# Altium project G431_MCU_Board.PrjPcb
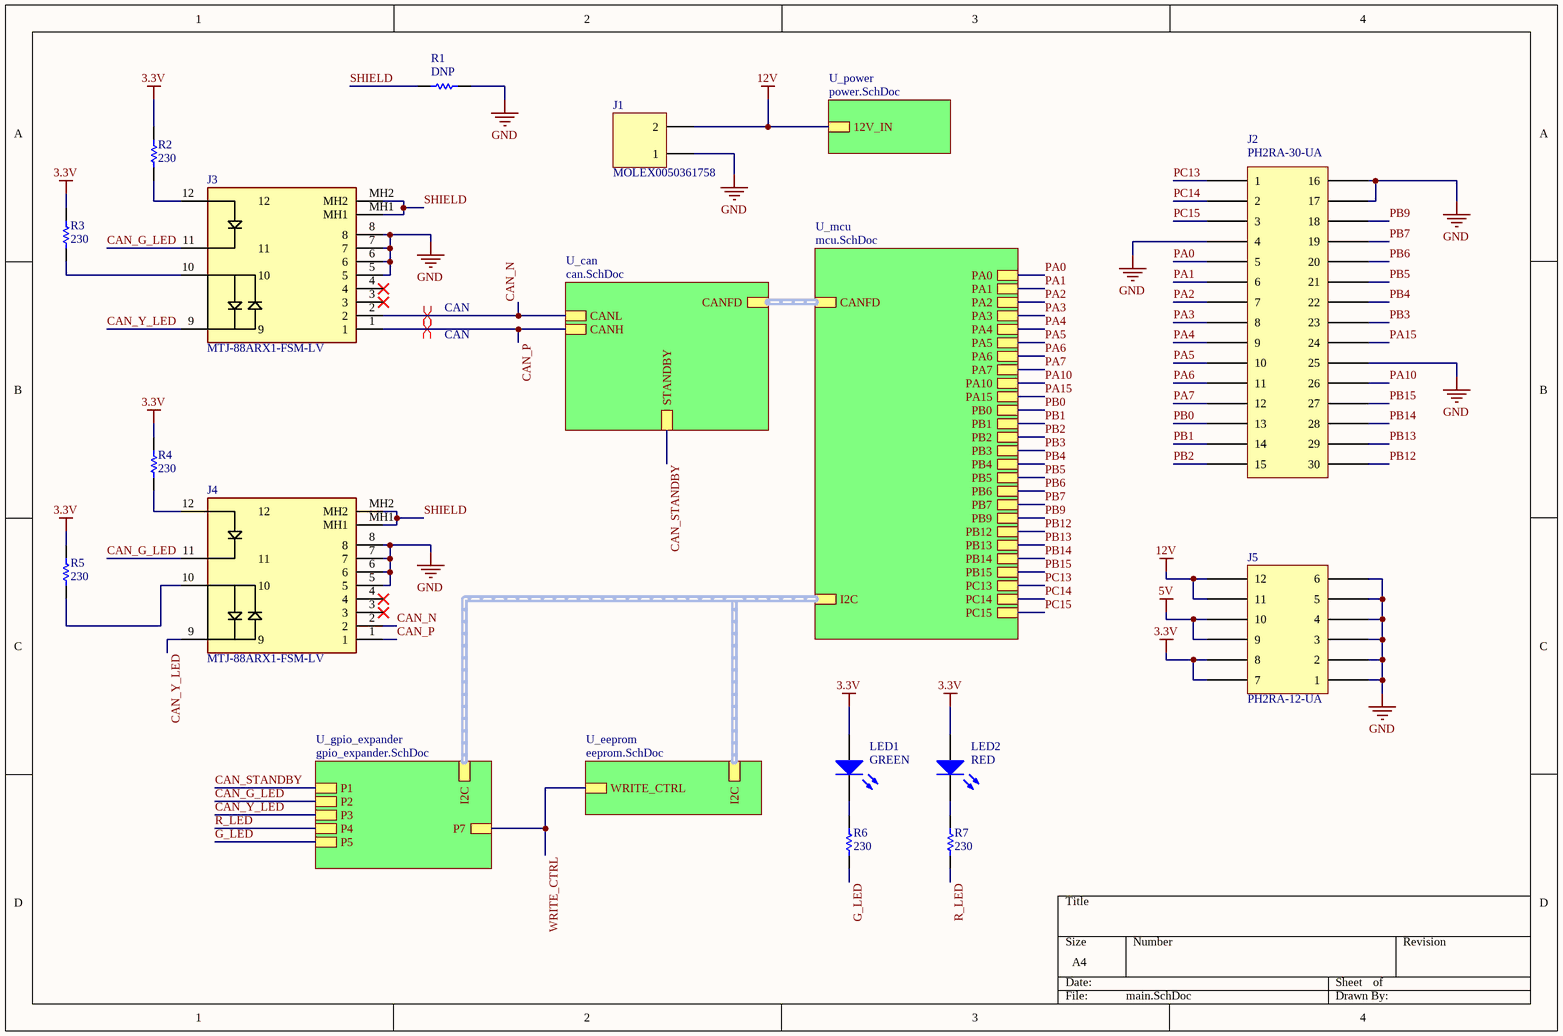
[diagram p0: main.SchDoc]
6 sheets, 51 parts. Net scope: hierarchical (ports join the sheet entries above them; power ports are global).
Board file: g431.PcbDoc
Sheets:
  main.SchDoc
    U_mcu = mcu.SchDoc
    U_power = power.SchDoc
    U_can = can.SchDoc
    U_eeprom = eeprom.SchDoc
    U_gpio_expander = gpio_expander.SchDoc

## Sheet main.SchDoc
size A4; SheetNumber: 1; SheetTotal: 6

### Parts
J1  MOLEX0050361758  [Molex0050361758]
J2  PH2RA-30-UA  [PH2RA-30-UA]
J3  MTJ-88ARX1-FSM-LV  [MTJ-88ARX1-FSM-LV]
J4  MTJ-88ARX1-FSM-LV  [MTJ-88ARX1-FSM-LV]
J5  PH2RA-12-UA  [PH2RA-12-UA]
LED1  GREEN  [0805 - DIODE]
LED2  RED  [0805 - DIODE]
R1  value DNP  [0603 - Resistor]  (hidden comment: Resistor)
R2  value 230  [0603 - Resistor]  (hidden comment: Resistor)
R3  value 230  [0603 - Resistor]  (hidden comment: Resistor)
R4  value 230  [0603 - Resistor]  (hidden comment: Resistor)
R5  value 230  [0603 - Resistor]  (hidden comment: Resistor)
R6  value 230  [0603 - Resistor]  (hidden comment: Resistor)
R7  value 230  [0603 - Resistor]  (hidden comment: Resistor)

### Sub-sheets
U_can = can.SchDoc: CANFD (harness CANFD), STANDBY, CANL, CANH
U_eeprom = eeprom.SchDoc: I2C (harness I2C), WRITE_CTRL
U_gpio_expander = gpio_expander.SchDoc: I2C (harness I2C), P7, P1, P2, P3, P5, P4
U_mcu = mcu.SchDoc: CANFD (harness CANFD), I2C (harness I2C), PA0, PA1, PA2, PA3, PA4, PA5, PA6, PA7, PA10, PA15, PB0, PB1, PB2, PB3, PB4, PB5, PB6, PB7, PB9, PB12, PB13, PB14, PB15, PC13, PC14, PC15
U_power = power.SchDoc: 12V_IN

### Nets
3.3V: J5.7 J5.8 LED1.1(A) LED2.1(A) R2.1 R3.1 R4.1 R5.1
5V: J5.9 J5.10
12V: J1.2 J5.11 J5.12 ; sheet U_power/12V_IN
GND: J1.1 J2.4 J2.16 J2.17 J2.25 J3.5 J3.6 J3.7 J3.8 J4.5 J4.6 J4.7 J4.8 J5.1 J5.2 J5.3 J5.4 J5.5 J5.6 R1.1
CAN_G_LED: J3.11 J4.11 ; sheet U_gpio_expander/P2
CAN_N: J3.2 J4.2 ; sheet U_can/CANL
CAN_P: J3.1 J4.1 ; sheet U_can/CANH
CAN_STANDBY: sheet U_can/STANDBY, sheet U_gpio_expander/P1
CAN_Y_LED: J3.9 J4.9 ; sheet U_gpio_expander/P3
G_LED: R6.2 ; sheet U_gpio_expander/P5
PA0: J2.5 ; sheet U_mcu/PA0
PA1: J2.6 ; sheet U_mcu/PA1
PA2: J2.7 ; sheet U_mcu/PA2
PA3: J2.8 ; sheet U_mcu/PA3
PA4: J2.9 ; sheet U_mcu/PA4
PA5: J2.10 ; sheet U_mcu/PA5
PA6: J2.11 ; sheet U_mcu/PA6
PA7: J2.12 ; sheet U_mcu/PA7
PA10: J2.26 ; sheet U_mcu/PA10
PA15: J2.24 ; sheet U_mcu/PA15
PB0: J2.13 ; sheet U_mcu/PB0
PB1: J2.14 ; sheet U_mcu/PB1
PB2: J2.15 ; sheet U_mcu/PB2
PB3: J2.23 ; sheet U_mcu/PB3
PB4: J2.22 ; sheet U_mcu/PB4
PB5: J2.21 ; sheet U_mcu/PB5
PB6: J2.20 ; sheet U_mcu/PB6
PB7: J2.19 ; sheet U_mcu/PB7
PB9: J2.18 ; sheet U_mcu/PB9
PB12: J2.30 ; sheet U_mcu/PB12
PB13: J2.29 ; sheet U_mcu/PB13
PB14: J2.28 ; sheet U_mcu/PB14
PB15: J2.27 ; sheet U_mcu/PB15
PC13: J2.1 ; sheet U_mcu/PC13
PC14: J2.2 ; sheet U_mcu/PC14
PC15: J2.3 ; sheet U_mcu/PC15
R_LED: R7.2 ; sheet U_gpio_expander/P4
SHIELD: J3.MH1 J3.MH2 J4.MH1 J4.MH2 R1.2
WRITE_CTRL: sheet U_eeprom/WRITE_CTRL, sheet U_gpio_expander/P7
NetJ3_10: J3.10 R3.2
NetJ3_12: J3.12 R2.2
NetJ4_10: J4.10 R5.2
NetJ4_12: J4.12 R4.2
NetLED1_2: LED1.2(K) R6.1
NetLED2_2: LED2.2(K) R7.1

Not connected (* = marked no-connect by the designer): J3 3* 4*; J4 3* 4*

### Buses and harness runs
harness sheet U_can/CANFD = sheet U_mcu/CANFD
harness sheet U_eeprom/I2C = sheet U_gpio_expander/I2C = sheet U_mcu/I2C

### Layout directives
differential pair; differential pair class CAN: CAN_N, CAN_P

### Library data of the parts
J1 = MOLEX0050361758: Connector Header Through Hole, Right Angle 2 position -; Manufacturer: Molex; Manufacturer Part Number: 0050361758; Supplier: DigiKey; ComponentLink1Description: Datasheet; ComponentLink1URL: https://www.molex.com/pdm_docs/ps/PS-5556-001.pdf; Supplier Part Number: 0050361758-ND
J2 = PH2RA-30-UA: Connector Header Through Hole, Right Angle 30 position 0.100" (2.54mm); Manufacturer: Adam Tech; Manufacturer Part Number: PH2RA-30-UA; Supplier: DigiKey; Supplier Part Number: 2057-PH2RA-30-UA-ND; ComponentLink1Description: Datasheet; ComponentLink1URL: https://app.adam-tech.com/products/download/data_sheet/200508/ph2ra-xx-ua-data-sheet.pdf
J3 J4 = MTJ-88ARX1-FSM-LV: RJ45 Connector
J5 = PH2RA-12-UA: Connector Header Through Hole, Right Angle 12 position 0.100" (2.54mm); Manufacturer: Adam Tech; Manufacturer Part Number: PH2RA-30-UA; Supplier: DigiKey; Supplier Part Number: 2057-PH2RA-30-UA-ND; ComponentLink1Description: Datasheet; ComponentLink1URL: https://app.adam-tech.com/products/download/data_sheet/200508/ph2ra-xx-ua-data-sheet.pdf
LED1 LED2 = LED: Light Emitting Diode; Value: *; Manufacturer Part Number: *; Manufacturer: *; Supplier Part Number: *; Rating: *; Supplier: *
R1-R7 = Resistor: Rating: *; Manufacturer Part Number: *; Manufacturer: *; Supplier Part Number: *; Supplier: *

## Sheet mcu.SchDoc
size A4; SheetNumber: 2; SheetTotal: 6
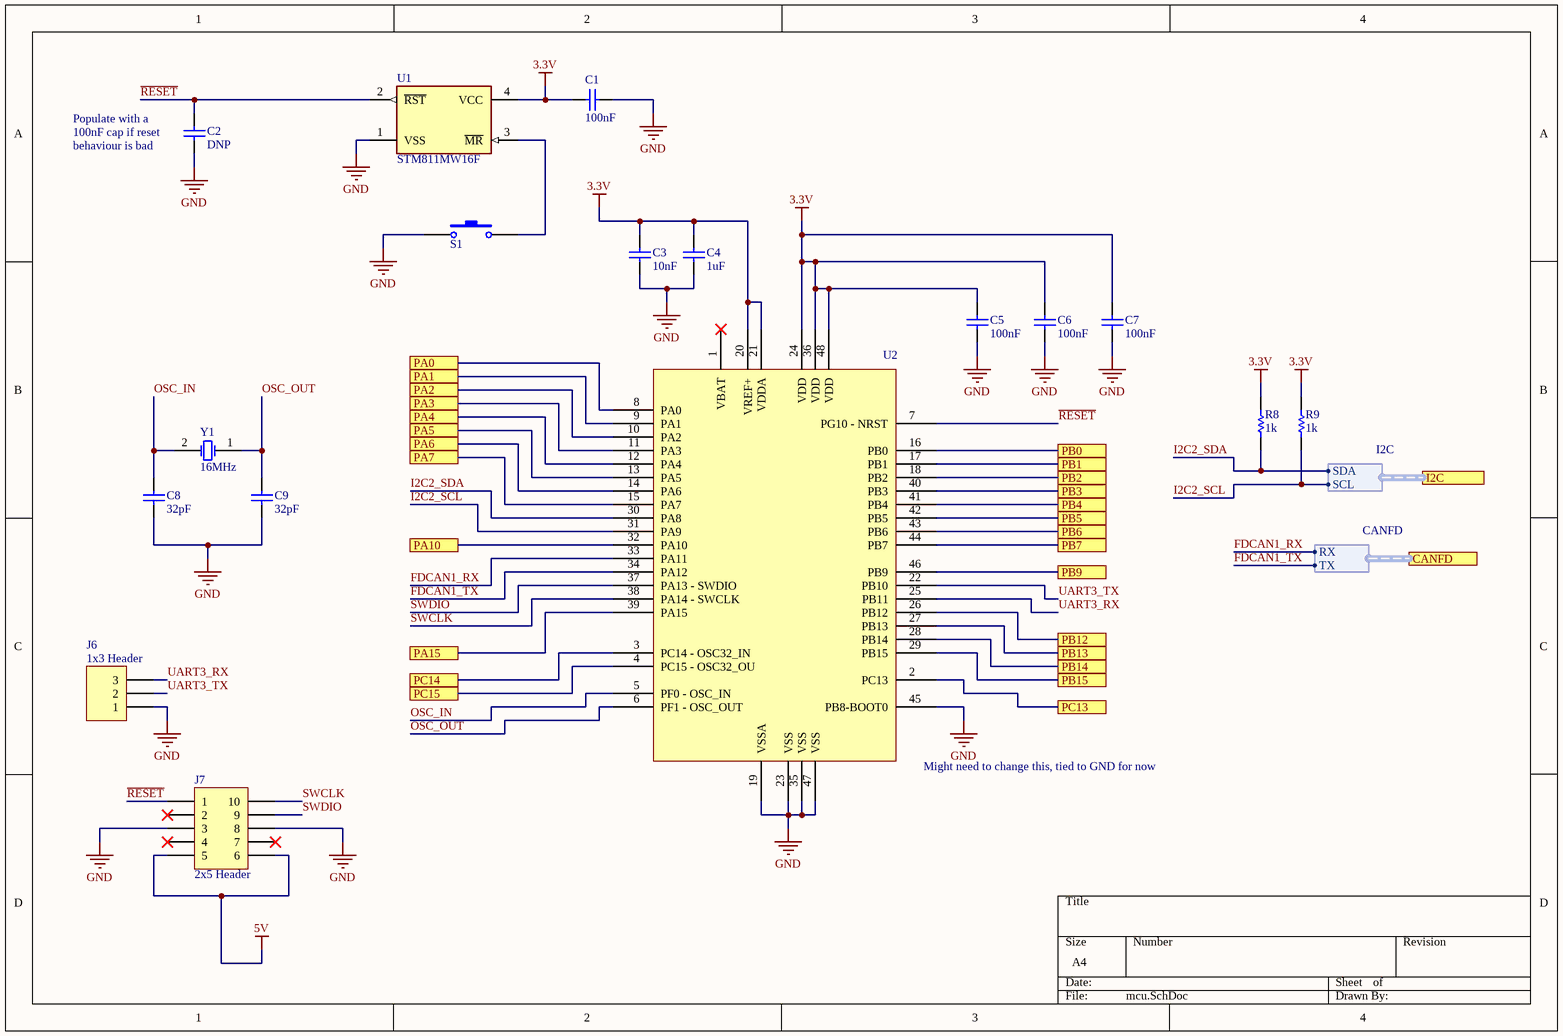
[diagram p1: mcu.SchDoc]

### Parts
C1  value 100nF  [0603 - Capacitor]  (hidden comment: Capacitor - Nonpolarized)
C2  value DNP  [0603 - Capacitor]  (hidden comment: Capacitor - Nonpolarized)
C3  value 10nF  [0603 - Capacitor]  (hidden comment: Capacitor - Nonpolarized)
C4  value 1uF  [0603 - Capacitor]  (hidden comment: Capacitor - Nonpolarized)
C5  value 100nF  [0603 - Capacitor]  (hidden comment: Capacitor - Nonpolarized)
C6  value 100nF  [0603 - Capacitor]  (hidden comment: Capacitor - Nonpolarized)
C7  value 100nF  [0603 - Capacitor]  (hidden comment: Capacitor - Nonpolarized)
C8  value 32pF  [0603 - Capacitor]  (hidden comment: Capacitor - Nonpolarized)
C9  value 32pF  [0603 - Capacitor]  (hidden comment: Capacitor - Nonpolarized)
J6  1x3 Header  [HDR1X3]
J7  2x5 Header  [HDR2x5]
R8  value 1k  [0603 - Resistor]  (hidden comment: Resistor)
R9  value 1k  [0603 - Resistor]  (hidden comment: Resistor)
S1  Switch - Push Button  [6x6mm Switch]  (value not drawn)
U1  STM811MW16F  [FP-SOT143-4-MFG]
U2  STM32G431C6T6  [TSQFP50P900X900X160-48N]  (value not drawn)
Y1  value 16MHz  [2-SMD NO LEAD CRSYSTAL]  (hidden comment: Oscillator)

### Ports
CANFD (harness CANFD), I2C (harness I2C), PA0, PA1, PA2, PA3, PA4, PA5, PA6, PA7, PA10, PA15, PB0, PB1, PB2, PB3, PB4, PB5, PB6, PB7, PB9, PB12, PB13, PB14, PB15, PC13, PC14, PC15

### Harnesses
CANFD: RX, TX
I2C: SDA, SCL

### Nets
3.3V: C1.2 C3.2 C4.2 C5.2 C6.2 C7.2 R8.2 R9.2 U1.4(VCC) U2.20(VREF+) U2.21(VDDA) U2.24(VDD) U2.36(VDD) U2.48(VDD)
5V: J7.5 J7.6
GND: C1.1 C2.1 C3.1 C4.1 C5.1 C6.1 C7.1 C8.1 C9.1 J6.1 J7.3 J7.8 S1.2 U1.1(VSS) U2.19(VSSA) U2.23(VSS) U2.35(VSS) U2.45(PB8-BOOT0) U2.47(VSS)
FDCAN1_RX: U2.33(PA11) ; port CANFD.RX
FDCAN1_TX: U2.34(PA12) ; port CANFD.TX
I2C2_SCL: R9.1 U2.31(PA9) ; port I2C.SCL
I2C2_SDA: R8.1 U2.30(PA8) ; port I2C.SDA
OSC_IN: C8.2 U2.5(PF0_-_OSC_IN) Y1.2(OSC2)
OSC_OUT: C9.2 U2.6(PF1_-_OSC_OUT) Y1.1(OSC1)
PA0: U2.8(PA0) ; port PA0
PA1: U2.9(PA1) ; port PA1
PA2: U2.10(PA2) ; port PA2
PA3: U2.11(PA3) ; port PA3
PA4: U2.12(PA4) ; port PA4
PA5: U2.13(PA5) ; port PA5
PA6: U2.14(PA6) ; port PA6
PA7: U2.15(PA7) ; port PA7
PA10: U2.32(PA10) ; port PA10
PA15: U2.39(PA15) ; port PA15
PB0: U2.16(PB0) ; port PB0
PB1: U2.17(PB1) ; port PB1
PB2: U2.18(PB2) ; port PB2
PB3: U2.40(PB3) ; port PB3
PB4: U2.41(PB4) ; port PB4
PB5: U2.42(PB5) ; port PB5
PB6: U2.43(PB6) ; port PB6
PB7: U2.44(PB7) ; port PB7
PB9: U2.46(PB9) ; port PB9
PB12: U2.26(PB12) ; port PB12
PB13: U2.27(PB13) ; port PB13
PB14: U2.28(PB14) ; port PB14
PB15: U2.29(PB15) ; port PB15
PC13: U2.2(PC13) ; port PC13
PC14: U2.3(PC14_-_OSC32_IN) ; port PC14
PC15: U2.4(PC15_-_OSC32_OU) ; port PC15
~{RESET}: C2.2 J7.1 U1.2(~{RST}) U2.7(PG10_-_NRST)
SWCLK: J7.10 U2.38(PA14_-_SWCLK)
SWDIO: J7.9 U2.37(PA13_-_SWDIO)
UART3_RX: J6.3 U2.25(PB11)
UART3_TX: J6.2 U2.22(PB10)
NetS1_1: S1.1 U1.3(~{MR})

Not connected (* = marked no-connect by the designer): J7 2* 4* 7*; U2 1(VBAT)*

### Notes on the sheet
- (near C2) Populate with a
- (near C2) 100nF cap if reset
- (near C2) behaviour is bad
- (near U2) Might need to change this, tied to GND for now

### Library data of the parts
C1-C9 = Capacitor - Nonpolarized: Nonpolarized Capacitor; Supplier Part Number: *; Supplier: *; Manufacturer: *; Rating: *; Manufacturer Part Number: *
J6 = 1x3 Header: 1x3 Pin Header
J7 = 2x5 Header: 2x5 Pin Header
S1 = Switch - Push Button: Push Button Switch; Supplier: *; Manufacturer Part Number: *; Manufacturer: *; Supplier Part Number: *; Rating: *; Value: *
U1 = CMP-12155-000003-1: IC MPU RESET CIRC 4.38V SOT143-4; Manufacturer: STMicroelectronics; Standoff Height: 0.01mm; Max Power Dissipation: 320mW; Number Of Outputs: 1; Reset Type: Active Low; Min Supply Voltage: 1V; Nominal Supply Current: 5.5-7uA; Max Supply Voltage: 5.5V; Output Current: 20mA; Lead Free: Yes; Category: IC; Mouser Description: Supervisory Circuits 4.38V Reset 140ms; Automotive: No; Threshold Voltage: 4.38V; Temperature Range High: +85°C; ComponentLink2URL: https://www.st.com/resource/en/datasheet/stm811.pdf; Device Class L1: Integrated Circuits (ICs); Ambient Temperature Range High: +85°C; Height: 1.12mm; Digikey Description: IC MPU RESET CIRC 4.38V SOT143-4; ComponentLink2Description: Datasheet; RoHS: TRUE; Temperature Range Low: -40°C; Device Class L2: Power Management ICs; Temperature: -40°C to +85°C; Package: SOT143-4; Device Class L3: Voltage Supervisors; Octopart: https://octopart.com/stm811mw16f-stmicroelectronics-506032; Manufacturer Part Number: STM811MW16F; Ambient Temperature Range Low: -40°C
U2 = STM32G431C6T6: MCU 32BIT 32KB FLASH 48LQFP; Manufacturer: ST; Manufacturer Part Number: STM32G431C6T6; Supplier: Digikey; Supplier Part Number: STM32G431C6T6-ND
Y1 = Oscillator: Crystal Oscillator; Manufacturer Part Number: *; Manufacturer: *; Supplier Part Number: *; Supplier: *; Rating: *
R8 R9 = Resistor: Rating: *; Manufacturer Part Number: *; Manufacturer: *; Supplier Part Number: *; Supplier: *

## Sheet power.SchDoc
size A4; SheetNumber: 3; SheetTotal: 6
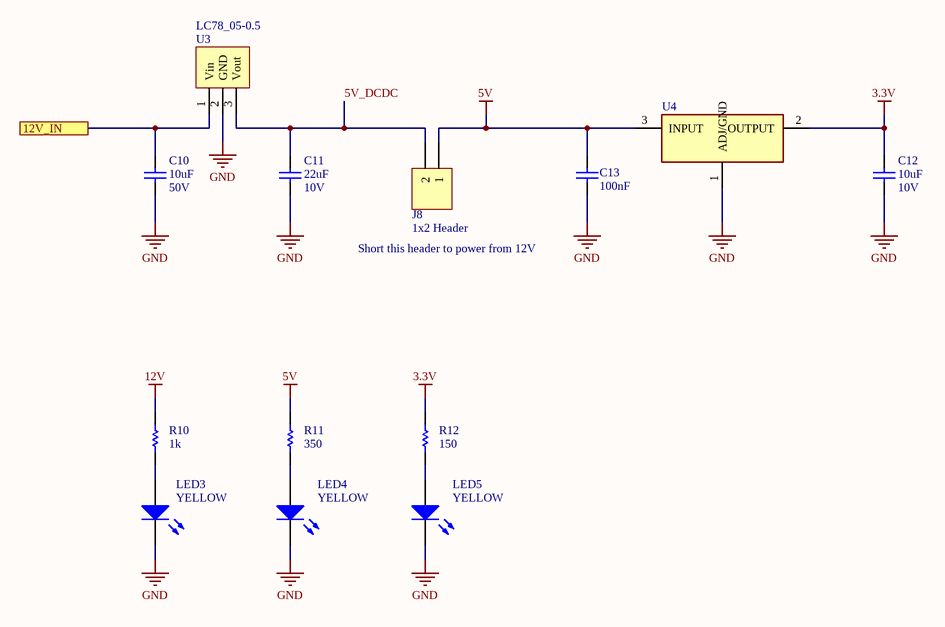
[diagram p2: power.SchDoc]

### Parts
C10  value 10uF  Volt Rating: 50V  [0805 - Capacitor]  (hidden comment: Capacitor - Nonpolarized)
C11  value 22uF  Volt Rating: 10V  [0805 - Capacitor]  (hidden comment: Capacitor - Nonpolarized)
C12  value 10uF  Volt Rating: 10V  [0805 - Capacitor]  (hidden comment: Capacitor - Nonpolarized)
C13  value 100nF  [0805 - Capacitor]  (hidden comment: Capacitor - Nonpolarized)
J8  1x2 Header  [HDR1X2]
LED3  YELLOW  [0805 - DIODE]
LED4  YELLOW  [0805 - DIODE]
LED5  YELLOW  [0805 - DIODE]
R10  value 1k  [0603 - Resistor]  (hidden comment: Resistor)
R11  value 350  [0603 - Resistor]  (hidden comment: Resistor)
R12  value 150  [0603 - Resistor]  (hidden comment: Resistor)
U3  LC78_05-0.5  [LC78_05-0.5]
U4  TLV1117-33IDCYR  [TLV1117]  (value not drawn)

### Ports
12V_IN

### Nets
3.3V: C12.2 R12.2 U4.2(OUTPUT)
5V: C13.2 J8.1 R11.2 U4.3(INPUT)
12V: C10.2 R10.2 U3.1(Vin) ; port 12V_IN
GND: C10.1 C11.1 C12.1 C13.1 LED3.2(K) LED4.2(K) LED5.2(K) U3.2(GND) U4.1(ADJ/GND)
5V_DCDC: C11.2 J8.2 U3.3(Vout)
NetLED3_1: LED3.1(A) R10.1
NetLED4_1: LED4.1(A) R11.1
NetLED5_1: LED5.1(A) R12.1

### Notes on the sheet
- Short this header to power from 12V

### Library data of the parts
C10-C13 = Capacitor - Nonpolarized: Nonpolarized Capacitor; Supplier Part Number: *; Supplier: *; Manufacturer: *; Rating: *; Manufacturer Part Number: *
J8 = 1x2 Header: 1x2 Pin Header
LED3-LED5 = LED: Light Emitting Diode; Value: *; Manufacturer Part Number: *; Manufacturer: *; Supplier Part Number: *; Rating: *; Supplier: *
U3 = LC78_05-0.5: Non-Isolated PoL Module DC DC Converter 1 Output 5V 500mA 6.8V - 28V Input; Manufacturer: GAPTEC Electronic. KG; Manufacturer Part Number: LC78_05-0.5; RoHS: No; Supplier 1: Digi-Key; Supplier Part Number 1: 3182-LC78_05-0.5-ND
U4 = TLV1117-33IDCYR: Linear Voltage Regulator IC 3.3V 800MA SOT223-4; Manufacturer: Texas Instruments; Manufacturer Part Number: TLV1117-33IDCYR; Supplier Part Number: 296-21112-1-ND; Supplier: Digikey; ComponentLink1Description: Datasheet; ComponentLink1URL: http://www.ti.com/lit/ds/symlink/tlv1117.pdf?HQS=TI-null-null-digikeymode-df-pf-null-wwe&ts=1590668900314
R10-R12 = Resistor: Rating: *; Manufacturer Part Number: *; Manufacturer: *; Supplier Part Number: *; Supplier: *

## Sheet can.SchDoc
size A4; SheetNumber: 4; SheetTotal: 6
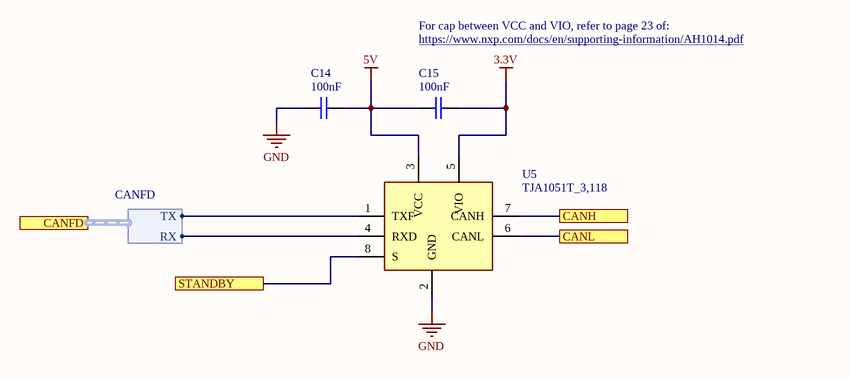
[diagram p3: can.SchDoc]

### Parts
C14  value 100nF  [0603 - Capacitor]  (hidden comment: Capacitor - Nonpolarized)
C15  value 100nF  [0603 - Capacitor]  (hidden comment: Capacitor - Nonpolarized)
U5  TJA1051T_3,118  [TJA1051T/3,118 - duplicate]

### Ports
CANFD (harness CANFD), CANH, CANL, STANDBY

### Harnesses
CANFD: RX, TX

### Nets
3.3V: C15.2 U5.5(VIO)
5V: C14.2 C15.1 U5.3(VCC)
GND: C14.1 U5.2(GND)
CAN_N: U5.6(CANL) ; port CANL
CAN_P: U5.7(CANH) ; port CANH
CAN_STANDBY: U5.8(S) ; port STANDBY
FDCAN1_RX: U5.4(RXD) ; port CANFD.RX
FDCAN1_TX: U5.1(TXF) ; port CANFD.TX

### Notes on the sheet
- For cap between VCC and VIO, refer to page 23 of:
- https://www.nxp.com/docs/en/supporting-information/AH1014.pdf

### Library data of the parts
C14 C15 = Capacitor - Nonpolarized: Nonpolarized Capacitor; Supplier Part Number: *; Supplier: *; Manufacturer: *; Rating: *; Manufacturer Part Number: *
U5 = TJA1051T_3,118: CAN Transceiver IC 4.5V-5.5V 250ns; Manufacturer: NXP; Manufacturer Part Number: TJA1051T/3,118; Supplier Part Number: 568-8684-1-ND; Supplier: Digikey; ComponentLink1Description: Datasheet; ComponentLink1URL: http://www.nxp.com/docs/en/data-sheet/TJA1051.pdf

## Sheet eeprom.SchDoc
size A4; SheetNumber: 5; SheetTotal: 6
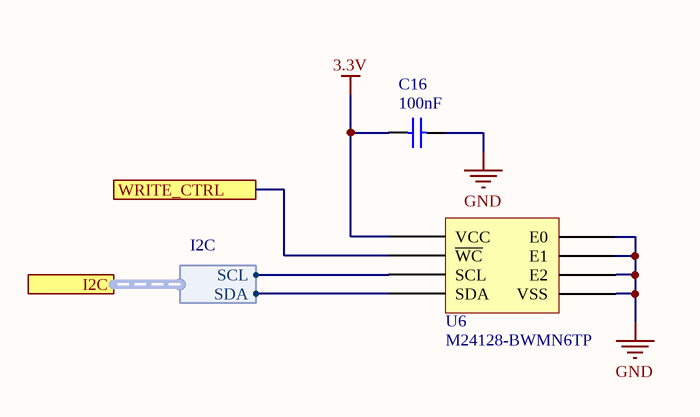
[diagram p4: eeprom.SchDoc]

### Parts
C16  value 100nF  [0603 - Capacitor]  (hidden comment: Capacitor - Nonpolarized)
U6  (no value)  [SOIC127P600X175-8N]

### Ports
I2C (harness I2C), WRITE_CTRL

### Harnesses
I2C: SDA, SCL

### Nets
3.3V: C16.1 U6.8(VCC)
GND: C16.2 U6.1(E0) U6.2(E1) U6.3(E2) U6.4(VSS)
I2C2_SCL: U6.6(SCL) ; port I2C.SCL
I2C2_SDA: U6.5(SDA) ; port I2C.SDA
WRITE_CTRL: U6.7(~{WC}) ; port WRITE_CTRL

### Library data of the parts
C16 = Capacitor - Nonpolarized: Nonpolarized Capacitor; Supplier Part Number: *; Supplier: *; Manufacturer: *; Rating: *; Manufacturer Part Number: *
U6 = M24128-BWMN6TP: EEPROM Memory IC 128Kb (16K x 8) I²C 1 MHz 450 ns 8-SOIC; Manufacturer_Name: STMicroelectronics; Datasheet Link: http://www.st.com/st-web-ui/static/active/en/resource/technical/document/datasheet/CD00259167.pdf; Height: 1.75mm; Supplier: Digi-Key; Supplier Part Number: 497-8621-2-ND; ComponentLink1Description: Datasheet; ComponentLink1URL: https://www.st.com/content/ccc/resource/technical/document/datasheet/59/05/c9/5b/7b/41/48/b6/CD00259167.pdf/files/CD00259167.pdf/jcr:content/translations/en.CD00259167.pdf; Manufacturer_Part_Number: M24128-BWMN6TP

## Sheet gpio_expander.SchDoc
size A4; SheetNumber: 6; SheetTotal: 6
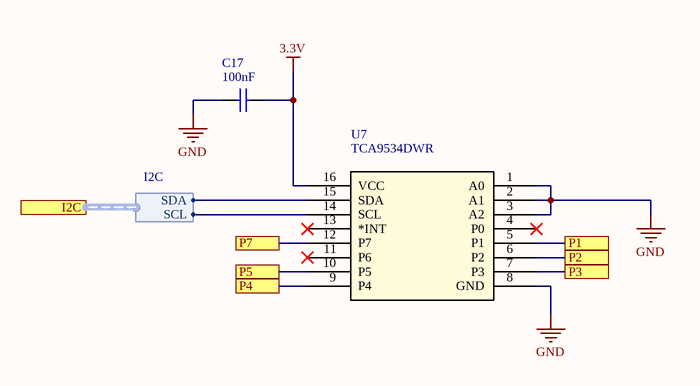
[diagram p5: gpio_expander.SchDoc]

### Parts
C17  value 100nF  [0603 - Capacitor]  (hidden comment: Capacitor - Nonpolarized)
U7  TCA9534DWR  [TCA9534DWR]

### Ports
I2C (harness I2C), P1, P2, P3, P4, P5, P7

### Harnesses
I2C: SCL, SDA

### Nets
3.3V: C17.2 U7.16(VCC)
GND: C17.1 U7.1(A0) U7.2(A1) U7.3(A2) U7.8(GND)
CAN_G_LED: U7.6(P2) ; port P2
CAN_STANDBY: U7.5(P1) ; port P1
CAN_Y_LED: U7.7(P3) ; port P3
G_LED: U7.10(P5) ; port P5
I2C2_SCL: U7.14(SCL) ; port I2C.SCL
I2C2_SDA: U7.15(SDA) ; port I2C.SDA
R_LED: U7.9(P4) ; port P4
WRITE_CTRL: U7.12(P7) ; port P7

Not connected (* = marked no-connect by the designer): U7 4(P0)* 11(P6)* 13(*INT)*

### Library data of the parts
C17 = Capacitor - Nonpolarized: Nonpolarized Capacitor; Supplier Part Number: *; Supplier: *; Manufacturer: *; Rating: *; Manufacturer Part Number: *
U7 = TCA9534DWR: Low Voltage 8-Bit I2C and SMBUS Low-Power I/O Expander with Interrupt / Output and Configuration Registers; Mfr_Name: Texas Instruments; Copyright: Copyright (C) 2022 Ultra Librarian. All rights reserved.; Manufacturer_Part_Number: TCA9534DWR; Digi-Key_Part_Number_1: 296-47827-1-ND; Digi-Key_Part_Number_2: 296-47827-2-ND; Digi-Key_Part_Number_3: 296-47827-6-ND; RefDes: RefDes; Type: DEV

## Nets that join several sheets
3.3V: main (8 pins), mcu (14 pins), power (C12.2 R12.2 U4.2), can (C15.2 U5.5), eeprom (C16.1 U6.8), gpio_expander (C17.2 U7.16)
5V: main (J5.9 J5.10), mcu (J7.5 J7.6), power (C13.2 J8.1 R11.2 U4.3), can (C14.2 C15.1 U5.3)
12V: main (J1.2 J5.11 J5.12), power (C10.2 R10.2 U3.1)
GND: main (20 pins), mcu (19 pins), power (9 pins), can (C14.1 U5.2), eeprom (5 pins), gpio_expander (5 pins)
CAN_G_LED: main (J3.11 J4.11), gpio_expander (U7.6)
CAN_N: main (J3.2 J4.2), can (U5.6)
CAN_P: main (J3.1 J4.1), can (U5.7)
CAN_STANDBY: can (U5.8), gpio_expander (U7.5)
CAN_Y_LED: main (J3.9 J4.9), gpio_expander (U7.7)
FDCAN1_RX: mcu (U2.33), can (U5.4)
FDCAN1_TX: mcu (U2.34), can (U5.1)
G_LED: main (R6.2), gpio_expander (U7.10)
I2C2_SCL: mcu (R9.1 U2.31), eeprom (U6.6), gpio_expander (U7.14)
I2C2_SDA: mcu (R8.1 U2.30), eeprom (U6.5), gpio_expander (U7.15)
PA0: main (J2.5), mcu (U2.8)
PA1: main (J2.6), mcu (U2.9)
PA2: main (J2.7), mcu (U2.10)
PA3: main (J2.8), mcu (U2.11)
PA4: main (J2.9), mcu (U2.12)
PA5: main (J2.10), mcu (U2.13)
PA6: main (J2.11), mcu (U2.14)
PA7: main (J2.12), mcu (U2.15)
PA10: main (J2.26), mcu (U2.32)
PA15: main (J2.24), mcu (U2.39)
PB0: main (J2.13), mcu (U2.16)
PB1: main (J2.14), mcu (U2.17)
PB2: main (J2.15), mcu (U2.18)
PB3: main (J2.23), mcu (U2.40)
PB4: main (J2.22), mcu (U2.41)
PB5: main (J2.21), mcu (U2.42)
PB6: main (J2.20), mcu (U2.43)
PB7: main (J2.19), mcu (U2.44)
PB9: main (J2.18), mcu (U2.46)
PB12: main (J2.30), mcu (U2.26)
PB13: main (J2.29), mcu (U2.27)
PB14: main (J2.28), mcu (U2.28)
PB15: main (J2.27), mcu (U2.29)
PC13: main (J2.1), mcu (U2.2)
PC14: main (J2.2), mcu (U2.3)
PC15: main (J2.3), mcu (U2.4)
R_LED: main (R7.2), gpio_expander (U7.9)
WRITE_CTRL: eeprom (U6.7), gpio_expander (U7.12)